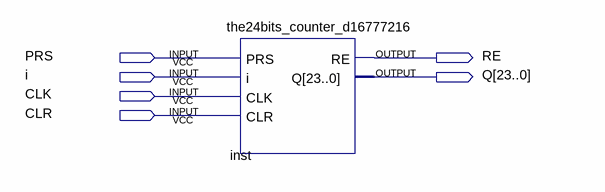
[diagram p0: schematic sheet]
// Quartus schematic main.bdf as structural Verilog: 1 symbols, 6 pins
module main (
  input  PRS,
  input  i,
  input  CLK,
  input  CLR,
  output RE,
  output [23:0] Q
);

  the24bits_counter_d16777216 inst (.PRS(PRS), .i(i), .CLK(CLK), .CLR(CLR), .RE(RE), .Q(Q));
endmodule
